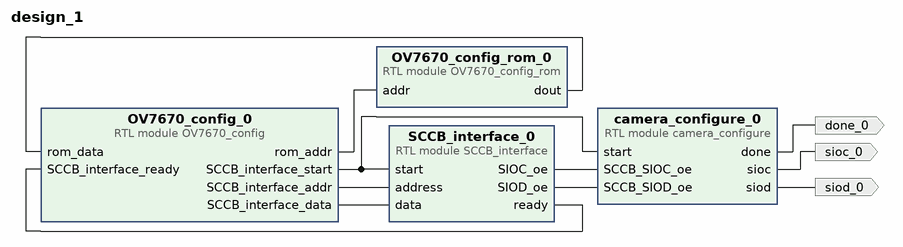
[diagram p0: block diagram of the top level]
# Vivado block design design_1, xc7z020clg400-1, Vivado 2017.4
create_bd_design design_1

create_bd_port -dir O sioc_0
create_bd_port -dir O done_0
create_bd_port -dir O siod_0

create_bd_cell -type module -reference OV7670_config OV7670_config_0
create_bd_cell -type module -reference OV7670_config_rom OV7670_config_rom_0
create_bd_cell -type module -reference SCCB_interface SCCB_interface_0
create_bd_cell -type module -reference camera_configure camera_configure_0

# ---- connections ----

connect_bd_net [get_bd_pins OV7670_config_0/rom_addr] [get_bd_pins OV7670_config_rom_0/addr]
connect_bd_net [get_bd_pins OV7670_config_rom_0/dout] [get_bd_pins OV7670_config_0/rom_data]
connect_bd_net [get_bd_pins OV7670_config_0/SCCB_interface_start] [get_bd_pins SCCB_interface_0/start] [get_bd_pins camera_configure_0/start]
connect_bd_net [get_bd_pins OV7670_config_0/SCCB_interface_addr] [get_bd_pins SCCB_interface_0/address]
connect_bd_net [get_bd_pins OV7670_config_0/SCCB_interface_data] [get_bd_pins SCCB_interface_0/data]
connect_bd_net [get_bd_pins SCCB_interface_0/ready] [get_bd_pins OV7670_config_0/SCCB_interface_ready]
connect_bd_net [get_bd_pins SCCB_interface_0/SIOC_oe] [get_bd_pins camera_configure_0/SCCB_SIOC_oe]
connect_bd_net [get_bd_pins SCCB_interface_0/SIOD_oe] [get_bd_pins camera_configure_0/SCCB_SIOD_oe]
connect_bd_net [get_bd_pins camera_configure_0/sioc] [get_bd_ports sioc_0]
connect_bd_net [get_bd_pins camera_configure_0/done] [get_bd_ports done_0]
connect_bd_net [get_bd_pins camera_configure_0/siod] [get_bd_ports siod_0]

validate_bd_design
save_bd_design
